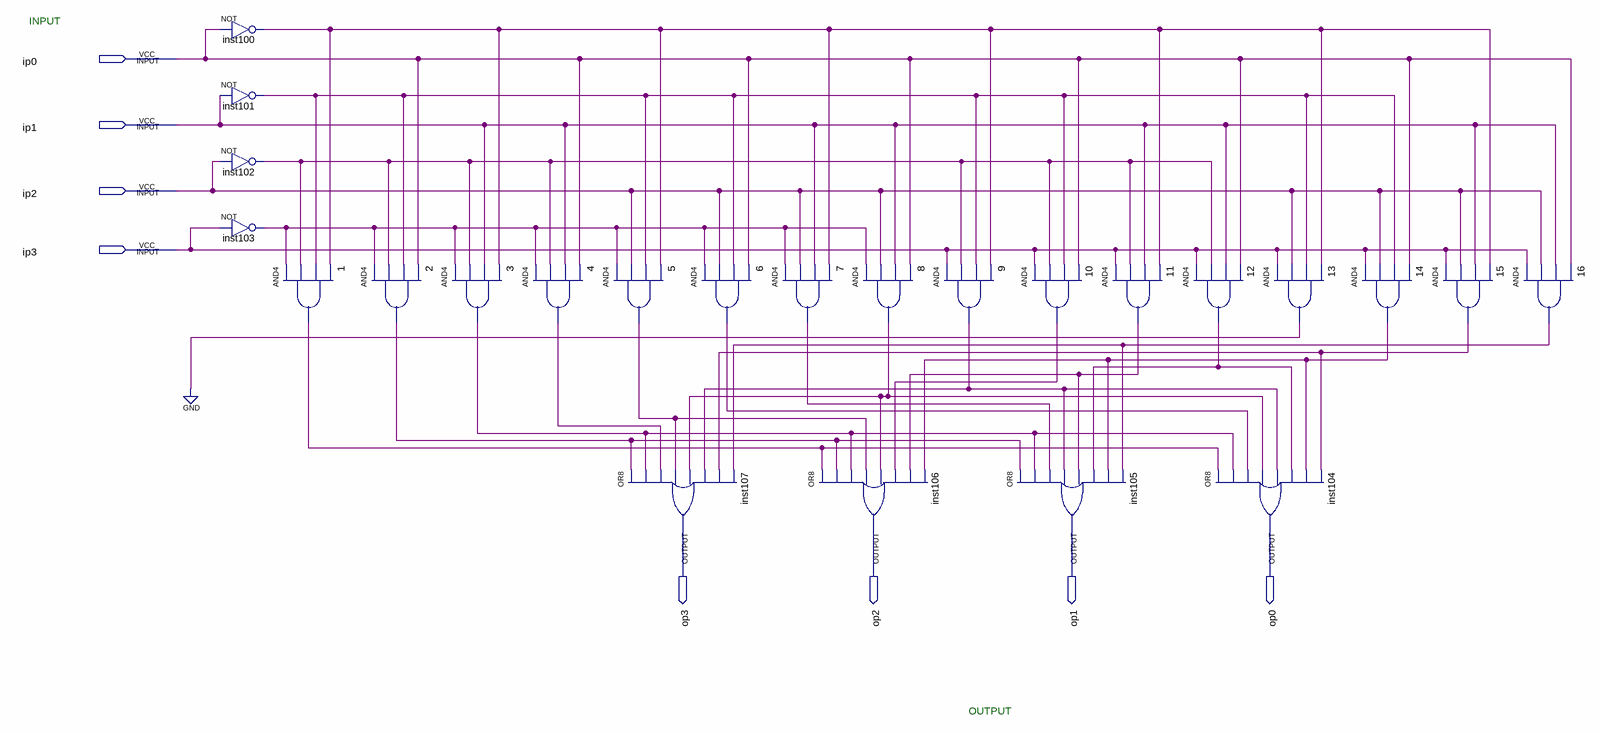
[diagram p0: schematic sheet]
// Quartus schematic ISbox.bdf as structural Verilog: 24 symbols, 8 pins
module ISbox (
  input  ip0,
  input  ip1,
  input  ip2,
  input  ip3,
  output op3,
  output op2,
  output op1,
  output op0
);

  wire inst100_out, inst101_out, inst102_out, inst103_out, n1_out, n2_out, n3_out, n4_out, n5_out, n6_out,
       n7_out, n8_out, n9_out, n10_out, n11_out, n12_out, n13_out, n14_out, n15_out, n16_out;

  not inst100 (inst100_out, ip0);
  not inst101 (inst101_out, ip1);
  not inst102 (inst102_out, ip2);
  not inst103 (inst103_out, ip3);
  and u_1 (n1_out, inst103_out, inst102_out, inst101_out, inst100_out);
  and u_2 (n2_out, inst103_out, inst102_out, inst101_out, ip0);
  and u_3 (n3_out, inst103_out, inst102_out, ip1, inst100_out);
  and u_4 (n4_out, inst103_out, inst102_out, ip1, ip0);
  and u_5 (n5_out, inst103_out, ip2, inst101_out, inst100_out);
  or inst107 (op3, n2_out, n3_out, n4_out, n5_out, n8_out, n9_out, n15_out, n16_out);
  and u_6 (n6_out, inst103_out, ip2, inst101_out, ip0);
  and u_7 (n7_out, inst103_out, ip2, ip1, inst100_out);
  and u_8 (n8_out, inst103_out, ip2, ip1, ip0);
  or inst106 (op2, n1_out, n2_out, n3_out, n5_out, n8_out, n10_out, n11_out, n14_out);
  and u_9 (n9_out, ip3, inst102_out, inst101_out, inst100_out);
  and u_10 (n10_out, ip3, inst102_out, inst101_out, ip0);
  or inst105 (op1, n2_out, n3_out, n7_out, n9_out, n11_out, n12_out, n14_out, n16_out);
  and u_11 (n11_out, ip3, inst102_out, ip1, inst100_out);
  and u_12 (n12_out, ip3, inst102_out, ip1, ip0);
  or inst104 (op0, n1_out, n3_out, n6_out, n8_out, n9_out, n12_out, n14_out, n15_out);
  and u_13 (n13_out, ip3, ip2, inst101_out, inst100_out);
  and u_14 (n14_out, ip3, ip2, inst101_out, ip0);
  and u_15 (n15_out, ip3, ip2, ip1, inst100_out);
  and u_16 (n16_out, ip3, ip2, ip1, ip0);
  // also tied to GND on the sheet: n13_out

  // Notes on the sheet:
  //   INPUT
  //   OUTPUT
endmodule
